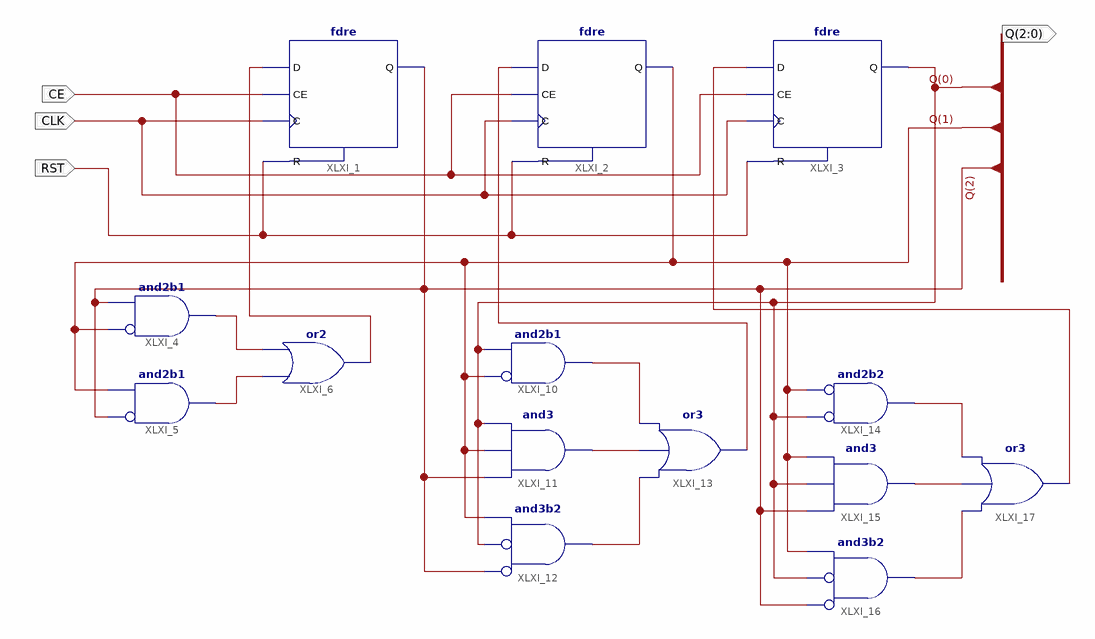
[diagram p0: schematic sheet 1]
// Xilinx ISE schematic licznik_rewersyjny.sch (xc9500xl) as structural Verilog: 14 symbols, 4 ports
module licznik_rewersyjny (
  input  CLK,
  input  RST,
  input  CE,
  output [2:0] Q
);

  wire XLXN_20, XLXN_21, XLXN_22, XLXN_25, XLXN_26, XLXN_27, XLXN_28, XLXN_31, XLXN_32, XLXN_33, XLXN_34;

  fdre XLXI_1 (.C(CLK), .CE(CE), .D(XLXN_22), .R(RST), .Q(Q[2]));
  fdre XLXI_2 (.C(CLK), .CE(CE), .D(XLXN_28), .R(RST), .Q(Q[1]));
  fdre XLXI_3 (.C(CLK), .CE(CE), .D(XLXN_34), .R(RST), .Q(Q[0]));
  and XLXI_4 (XLXN_20, ~Q[1], Q[2]);  // and2b1
  and XLXI_5 (XLXN_21, ~Q[2], Q[1]);  // and2b1
  or XLXI_6 (XLXN_22, XLXN_21, XLXN_20);
  and XLXI_10 (XLXN_25, ~Q[1], Q[0]);  // and2b1
  and XLXI_11 (XLXN_26, Q[2], Q[1], Q[0]);
  and XLXI_12 (XLXN_27, ~Q[2], ~Q[0], Q[1]);  // and3b2
  or XLXI_13 (XLXN_28, XLXN_27, XLXN_26, XLXN_25);
  and XLXI_14 (XLXN_32, ~Q[0], ~Q[1]);  // and2b2
  and XLXI_15 (XLXN_31, Q[2], Q[0], Q[1]);
  and XLXI_16 (XLXN_33, ~Q[2], ~Q[0], Q[1]);  // and3b2
  or XLXI_17 (XLXN_34, XLXN_33, XLXN_31, XLXN_32);
endmodule
